# EAGLE design 402_led_ring (EAGLE 7.6.0)
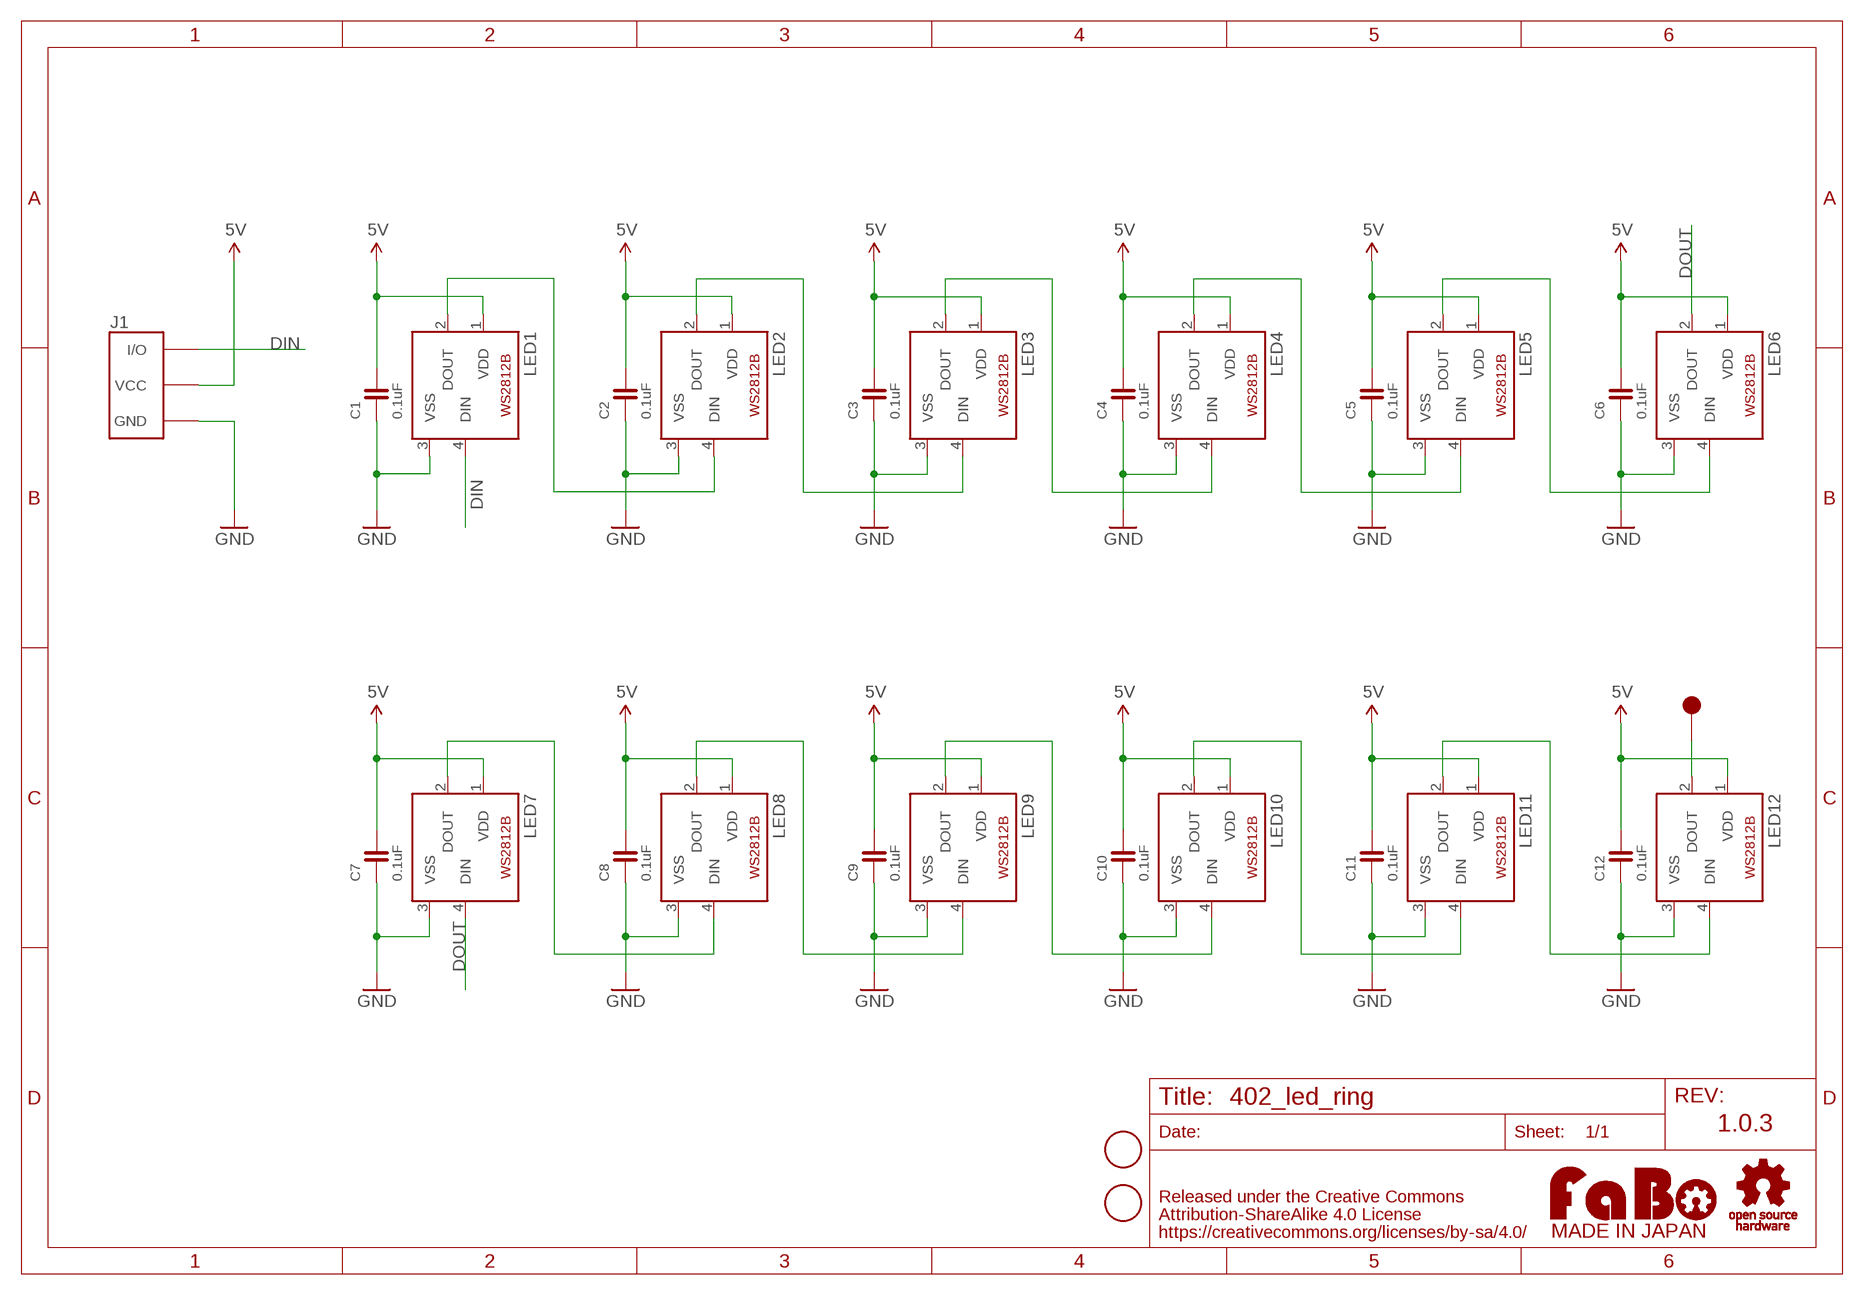
[diagram p0: schematic, sheet 1]

## Parts
C1  0.1uF  CAPACITOR-0603  [0603]
C2  0.1uF  CAPACITOR-0603  [0603]
C3  0.1uF  CAPACITOR-0603  [0603]
C4  0.1uF  CAPACITOR-0603  [0603]
C5  0.1uF  CAPACITOR-0603  [0603]
C6  0.1uF  CAPACITOR-0603  [0603]
C7  0.1uF  CAPACITOR-0603  [0603]
C8  0.1uF  CAPACITOR-0603  [0603]
C9  0.1uF  CAPACITOR-0603  [0603]
C10  0.1uF  CAPACITOR-0603  [0603]
C11  0.1uF  CAPACITOR-0603  [0603]
C12  0.1uF  CAPACITOR-0603  [0603]
J1  FABO_BRICK_3PIN-S03B-PASK-2_LONG  [FABO_BRICK_3PIN_S03B-PASK-2_LONG]
LED1  WS2812B  [WS2812B]
LED2  WS2812B  [WS2812B]
LED3  WS2812B  [WS2812B]
LED4  WS2812B  [WS2812B]
LED5  WS2812B  [WS2812B]
LED6  WS2812B  [WS2812B]
LED7  WS2812B  [WS2812B]
LED8  WS2812B  [WS2812B]
LED9  WS2812B  [WS2812B]
LED10  WS2812B  [WS2812B]
LED11  WS2812B  [WS2812B]
LED12  WS2812B  [WS2812B]
TP1  TP-10  [TP-10]
U$2  SCREW-PAD-3MM  [SCREWPAD_3MM]
U$3  SCREW-PAD-3MM  [SCREWPAD_3MM]
U$4  LOGO_OSHW-M_BOTTOM  [LOGO_OSHW_M_BOTTOM]
U$5  LOGO_FABO-M  [LOGO_FABO_MS]

## Nets
5V: C1.2 C2.2 C3.2 C4.2 C5.2 C6.2 C7.2 C8.2 C9.2 C10.2 C11.2 C12.2 J1.VCC LED1.1(VDD) LED2.1(VDD) LED3.1(VDD) LED4.1(VDD) LED5.1(VDD) LED6.1(VDD) LED7.1(VDD) LED8.1(VDD) LED9.1(VDD) LED10.1(VDD) LED11.1(VDD) LED12.1(VDD)
DIN: J1.I/O LED1.4(DIN)
DOUT: LED6.2(DOUT) LED7.4(DIN)
GND: C1.1 C2.1 C3.1 C4.1 C5.1 C6.1 C7.1 C8.1 C9.1 C10.1 C11.1 C12.1 J1.GND LED1.3(VSS) LED2.3(VSS) LED3.3(VSS) LED4.3(VSS) LED5.3(VSS) LED6.3(VSS) LED7.3(VSS) LED8.3(VSS) LED9.3(VSS) LED10.3(VSS) LED11.3(VSS) LED12.3(VSS)
N$1: LED1.2(DOUT) LED2.4(DIN)
N$2: LED2.2(DOUT) LED3.4(DIN)
N$3: LED3.2(DOUT) LED4.4(DIN)
N$4: LED4.2(DOUT) LED5.4(DIN)
N$5: LED5.2(DOUT) LED6.4(DIN)
N$6: LED7.2(DOUT) LED8.4(DIN)
N$7: LED8.2(DOUT) LED9.4(DIN)
N$8: LED9.2(DOUT) LED10.4(DIN)
N$9: LED10.2(DOUT) LED11.4(DIN)
N$10: LED11.2(DOUT) LED12.4(DIN)
N$11: LED12.2(DOUT) TP1.1

## Notes on the sheet
- 1.0.3

## Library data of the parts
C1-C12 = FaBo-Capacitor:CAPACITOR: CAPACITOR
J1 = FaBo-Template:FABO_BRICK_3PIN: FaBo Brick 3pin
LED1-LED12 = FaBo-LED:WS2812B
TP1 = FaBo-Supply:TP
U$2 U$3 = FaBo-etc:SCREW-PAD
U$4 = FaBo-etc:LOGO_OSHW
U$5 = FaBo-etc:LOGO_FABO

## Board
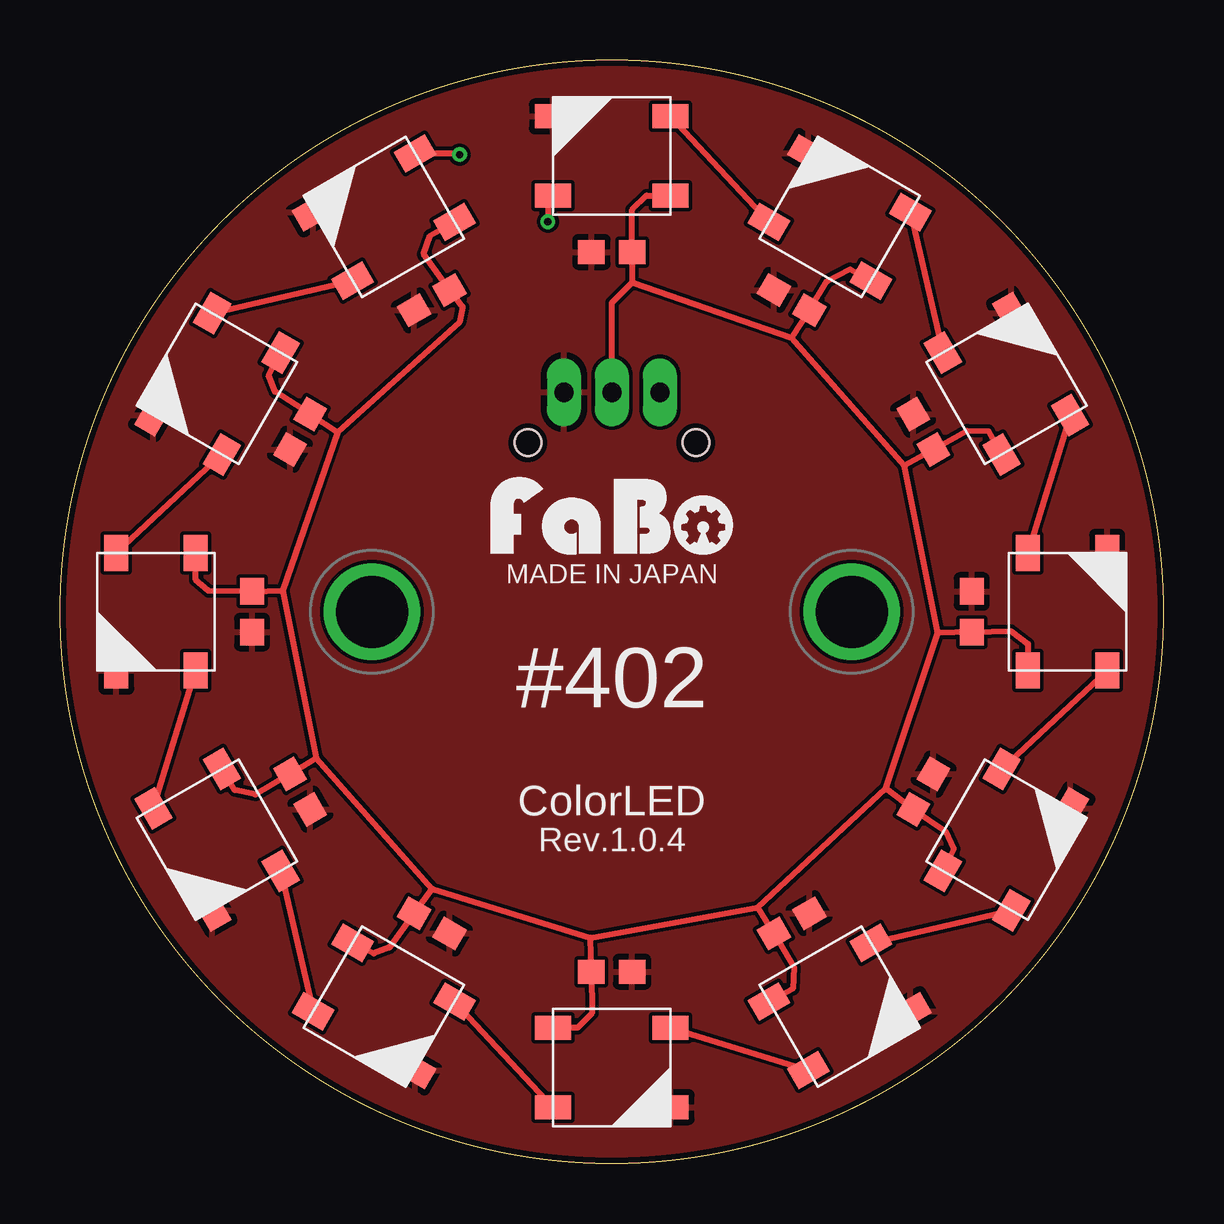
[diagram p1: board, top side]
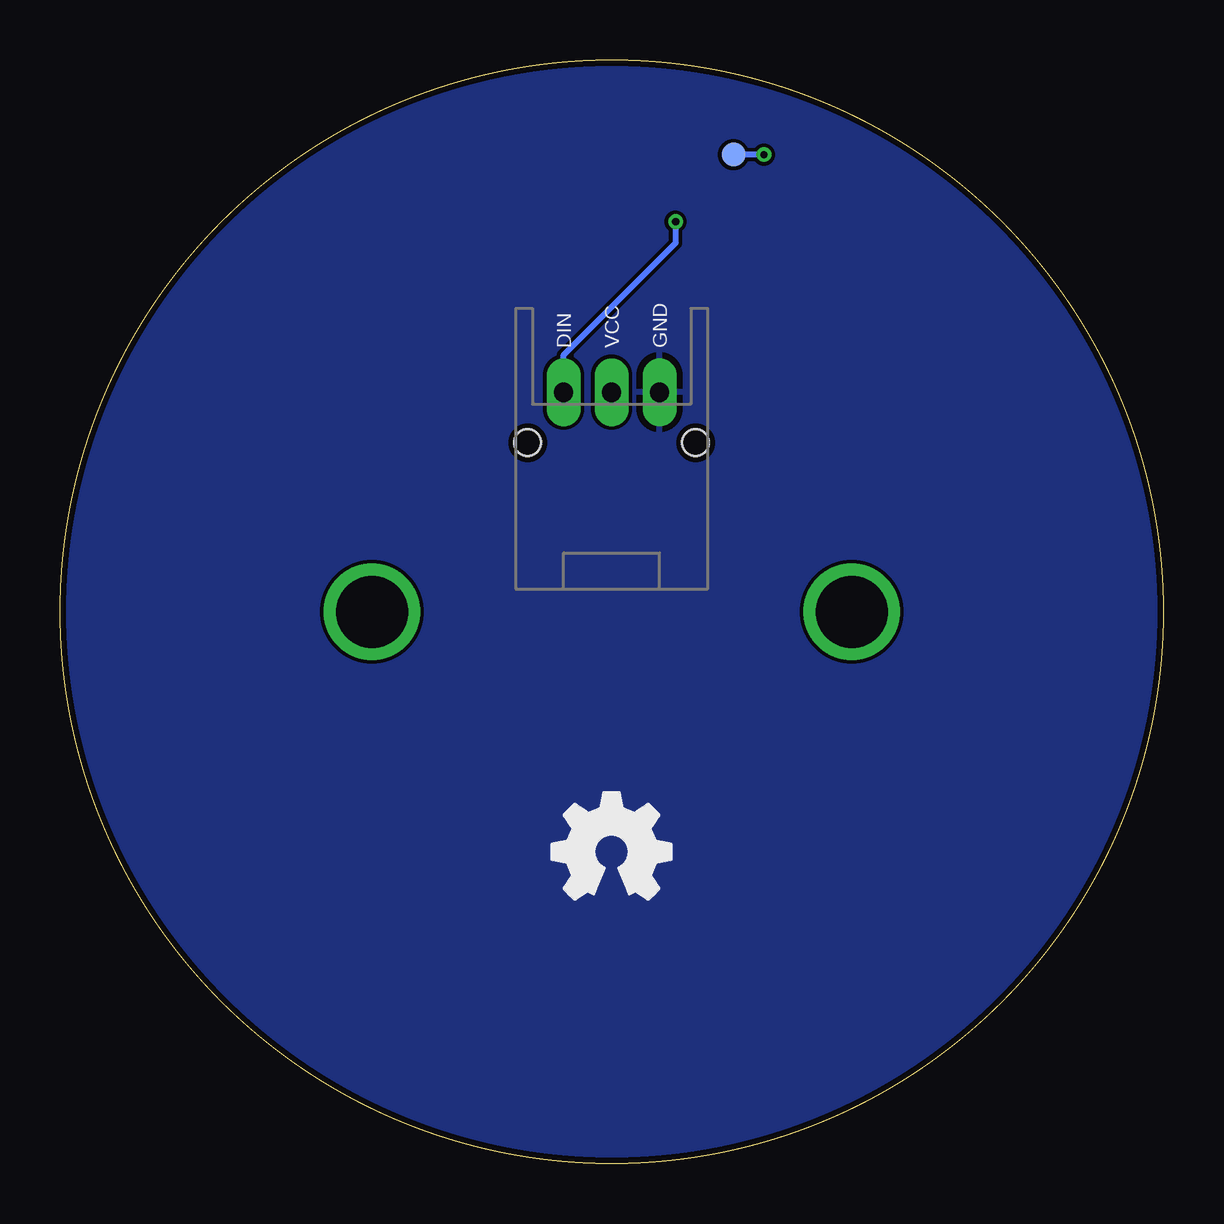
[diagram p2: board, bottom side, seen from below]

Size 46 x 46 mm. Coordinates in mm from the lower left corner, seen from the top.
Outline: circle at 23,23 radius 23
Copper layers (1*16): Top 0.035mm / dielectric 1.5mm / Bottom 0.035mm
Design rules "SeeedStudio_2layer_DRU_no_angle_20140221": minimum track width 6mil, minimum drill 12mil, track to track 6mil, track to pad 6mil, pad to pad 6mil, via to via 6mil, smd to smd 0mil, copper to edge 10mil, drill to drill 10mil, minimum pad ring 10mil, minimum via ring 6mil, stop-mask expansion 2mil, vias tented up to drill 100mil, thermal gap 10mil

### Footprints (pad centres in the part's own frame; a part is rotated, then mirrored left to right if it is on the bottom)
0603 = smd 1.1 x 1: 1 -0.85,0; 2 0.85,0
FABO_BRICK_3PIN_S03B-PASK-2_LONG = drill 0.8 pad 1.422 long: GND -2,0; I/O 2,0; VCC 0,0 | hole 1.1: 3.5,2.1; -3.5,2.1
WS2812B = smd 1.5 x 1: 1 -2.45,1.65; 2 -2.45,-1.65; 3 2.45,-1.65; 4 2.45,1.65
TP-10 = smd 1 x 1: 1 0,0
SCREWPAD_3MM = drill 3 pad 3.81: 1 0,0

### Placement (x,y rotation side)
C1  23,38 0 top
C2  30.5,35.99 330 top
C3  35.99,30.5 300 top
C4  38,23 270 top
C5  35.99,15.5 240 top
C6  30.5,10.01 210 top
C7  23,8 180 top
C8  15.5,10.01 150 top
C9  10.01,15.5 120 top
C10  8,23 90 top
C11  10.01,30.5 60 top
C12  15.5,35.99 30 top
J1  23.01,32.15 180 bottom
LED1  23,42 180 top
LED2  32.5,39.45 150 top
LED3  39.45,32.5 120 top
LED4  42,23 90 top
LED5  39.45,13.5 60 top
LED6  32.5,6.55 30 top
LED7  23,4 0 top
LED8  13.5,6.55 330 top
LED9  6.55,13.5 300 top
LED10  4,23 270 top
LED11  6.55,32.5 240 top
LED12  13.5,39.45 210 top
TP1  17.92,42.05 0 bottom
U$2  13,23 0 top
U$3  33,23 0 top
U$4  23,13 0 top
U$5  23,25 0 top

### Tracks (layer width: path | path; a pad name or v marks a point on that pad's centre or on a via)
5V
  Top 0.254: LED1.1 25.55,40.35 24.45,40.35 23.85,39.75 C1.2 23.85,36.77 23.89,36.72 | LED2.1 32.94,37.28 31.97,36.77 C2.2 30.5,34.44 | LED3.1 38.7,30.52 37.81,30.55 C3.2 35.2,29.1 | LED4.1 40.35,21.66 39.64,22.19 C4.2 36.59,22.12 | LED5.1 37.25,13.12 36.92,13.84 C5.2 34.44,15.64 | LED6.1 30.55,7.28 30.6,8.17 C6.2 29.1,10.69 | 23.89,36.72 30.5,34.44 | 30.5,34.44 35.2,29.1 | 36.59,22.12 35.2,29.1 | 34.44,15.64 36.59,22.12 | 29.1,10.69 34.44,15.64 | 22.12,9.42 29.1,10.69 | 15.51,11.45 22.12,9.42 | 10.69,16.91 15.51,11.45 | 9.29,23.89 10.69,16.91 | 11.57,30.5 9.29,23.89 | 11.57,30.5 16.66,35.07 16.78,35.7 C12.2 15.16,37.91 15.44,38.68 LED12.1 | 23.89,36.72 23.85,36.72 23.01,35.88 J1.VCC | 22.12,9.42 C7.2 22.17,6.27 21.58,5.66 LED7.1 | LED8.1 13.07,8.76 13.73,9.01 C8.2 15.51,11.45 | LED9.1 7.28,15.56 8.15,15.38 C9.2 10.69,16.91 | LED10.1 5.66,24.33 6.19,23.87 C10.2 9.29,23.89 | LED11.1 8.7,32.86 8.96,32.17 C11.2 11.57,30.5
DIN  (via drill 0.3)
  Top 0.254: LED1.4 20.34,40.02 v20.34,39.26
  Bottom 0.254: v20.34,39.26 20.34,38.37 25.01,33.7 J1.I/O
DOUT
  Top 0.254: LED7.4 LED6.2
GND
  pour Bottom: -0.49,-0.49 46.5,-0.49 46.5,46.5 -0.49,46.5
  pour Top: -0.49,-0.49 46.5,-0.49 46.5,46.5 -0.49,46.5
N$1
  Top 0.254: LED1.2 LED2.4
N$2
  Top 0.254: LED2.2 LED3.4
N$3
  Top 0.254: LED3.2 LED4.4
N$4
  Top 0.254: LED4.2 LED5.4
N$5
  Top 0.254: LED6.4 LED5.2
N$6
  Top 0.254: LED8.4 LED7.2
N$7
  Top 0.254: LED9.4 LED8.2
N$8
  Top 0.254: LED9.2 LED10.4
N$9
  Top 0.254: LED10.2 LED11.4
N$10
  Top 0.254: LED11.2 LED12.4
N$11  (via drill 0.3)
  Top 0.254: LED12.2 16.6,42.11 v16.66,42.05
  Bottom 0.254: v16.66,42.05 TP1.1

### Text on the board
tPlace: MADE IN JAPAN | #402 | ColorLED | Rev.1.0.4
bPlace: GND | VCC | DIN